# Altium project Main.PrjPcb
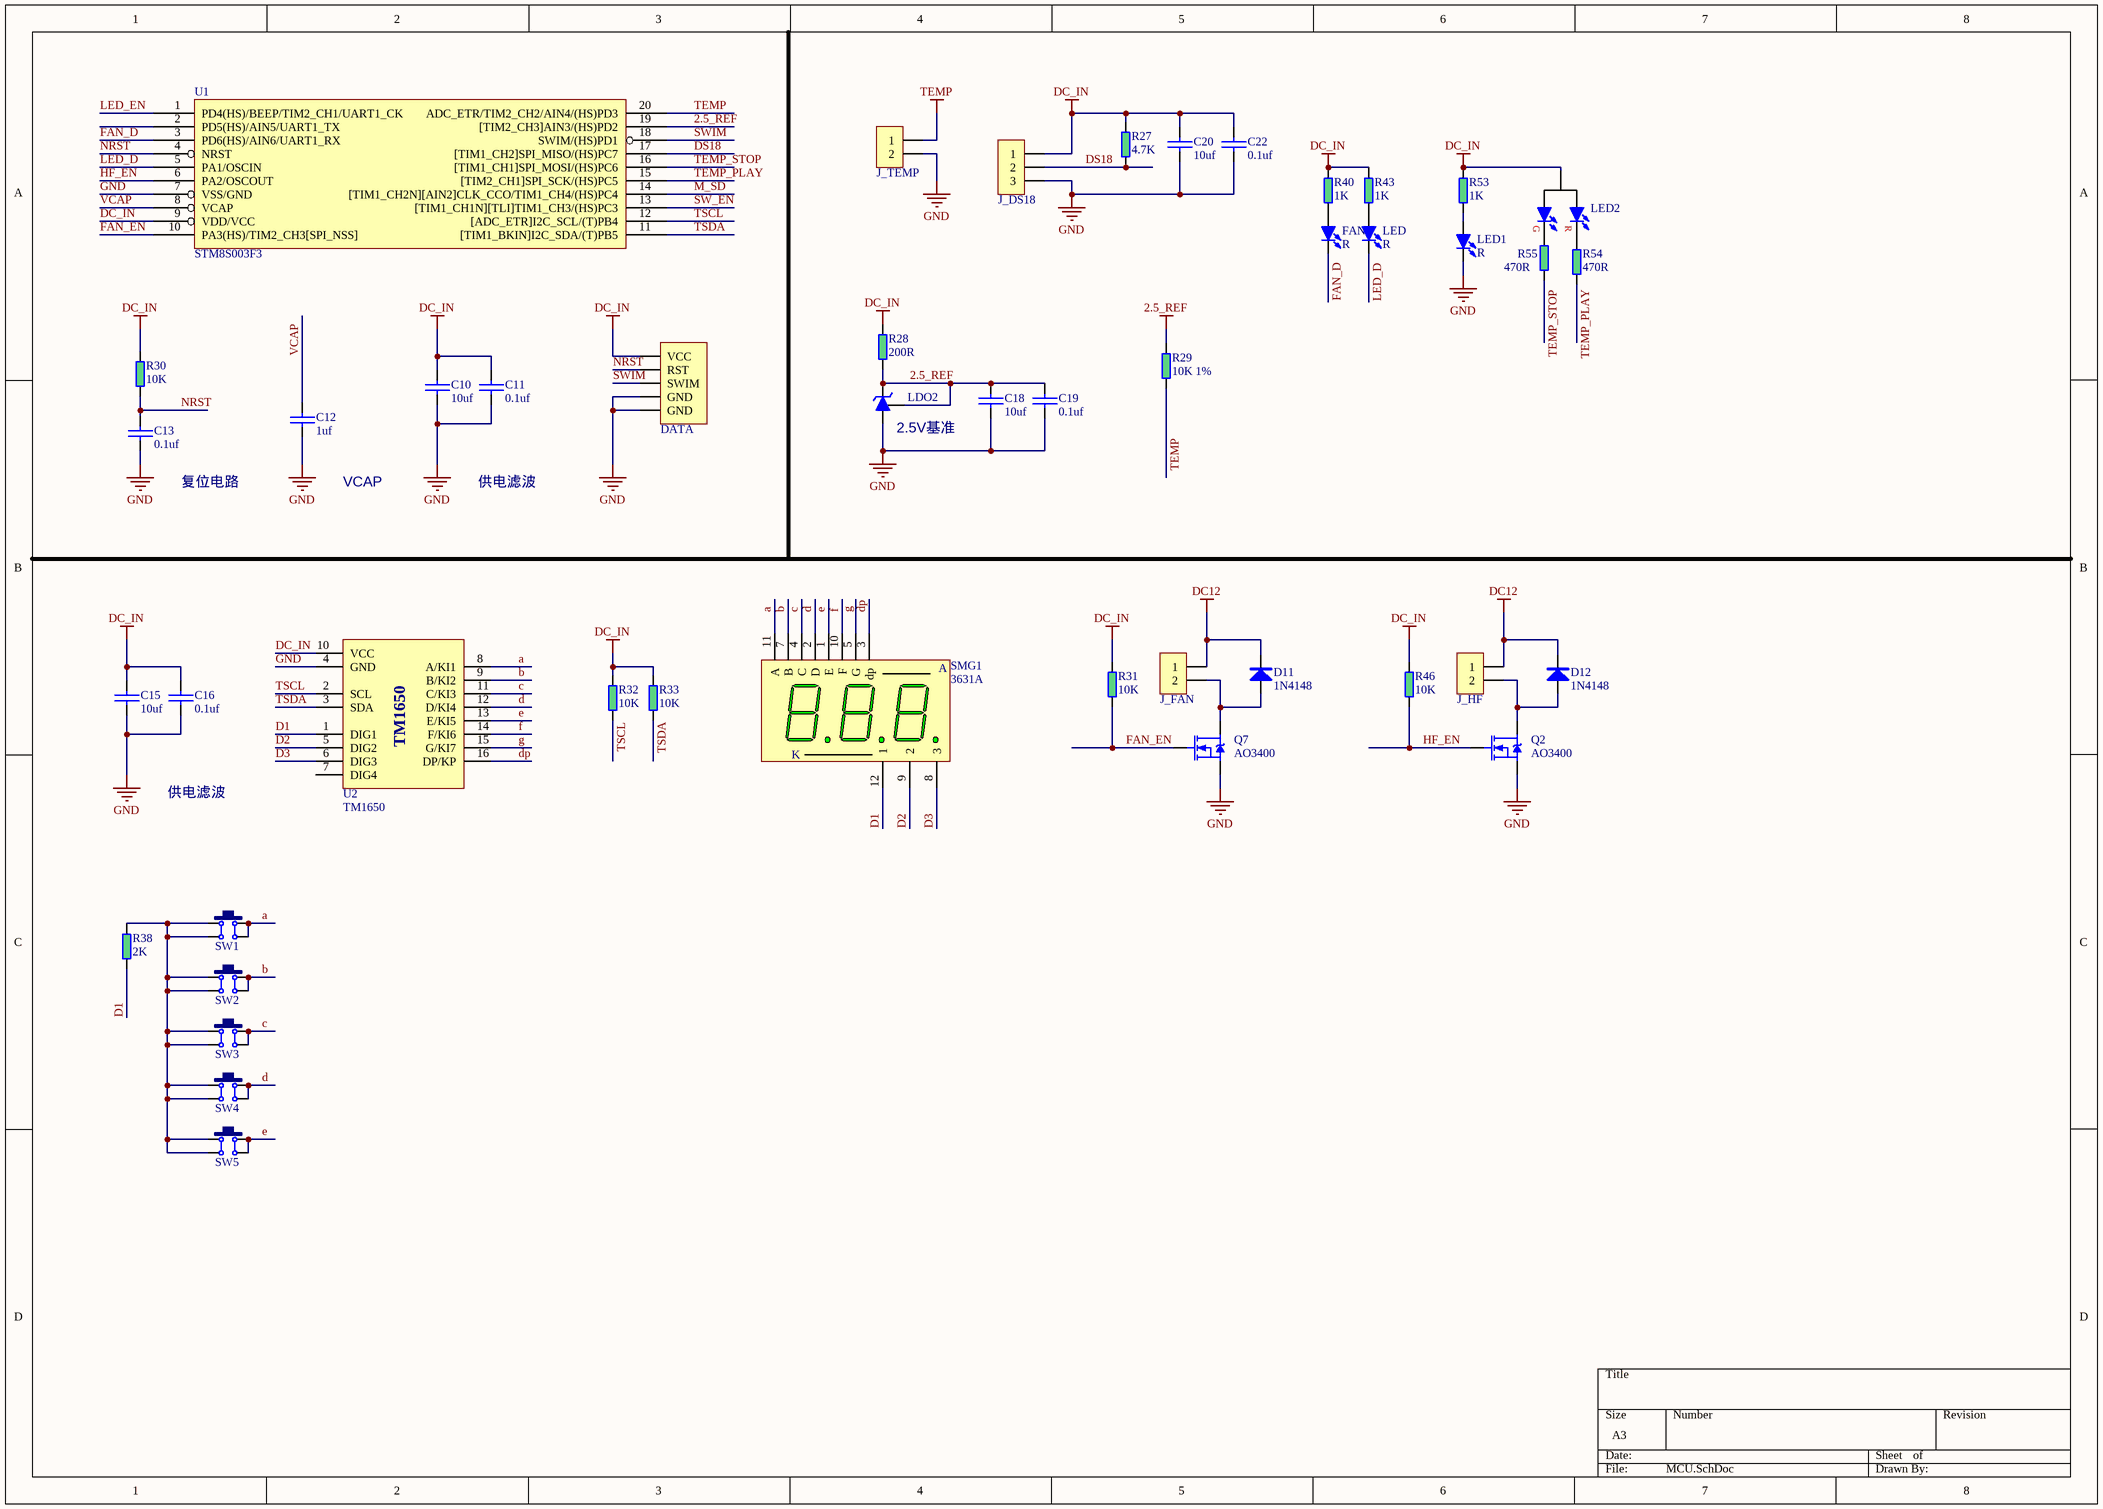
[diagram p0: MCU.SchDoc]
5 sheets, 143 parts. Net scope: global (net labels, ports and power ports of the same name join across sheets).
Board file: PCB1.PcbDoc
Sheets:
  MCU.SchDoc
  LM358.SchDoc
  AC.SchDoc
  5V.SchDoc
  LED.SchDoc

## Sheet MCU.SchDoc
size A3

### Parts
C10  value 10uf  [C 0603]  (hidden comment: 04.Cap)
C11  value 0.1uf  [C 0603]  (hidden comment: 04.Cap)
C12  value 1uf  [C 0603]  (hidden comment: 04.Cap)
C13  value 0.1uf  [C 0603]  (hidden comment: 04.Cap)
C15  value 10uf  [C 0603]  (hidden comment: 04.Cap)
C16  value 0.1uf  [C 0603]  (hidden comment: 04.Cap)
C18  value 10uf  [C 0603]  (hidden comment: 04.Cap)
C19  value 0.1uf  [C 0603]  (hidden comment: 04.Cap)
C20  value 10uf  [C 0603]  (hidden comment: 04.Cap)
C22  value 0.1uf  [C 0603]  (hidden comment: 04.Cap)
D11  1N4148  [D 1N4148-LL34]
D12  1N4148  [D 1N4148-LL34]
DATA  WR_STM-SWIM  [MCU_WRITE]  (value not drawn)
FAN  R  [LED 0603B]
J_DS18  Pin03  [XH2.54 3P]  (value not drawn)
J_FAN  Pin02  [XH2.54 2P]  (value not drawn)
J_HF  Pin02  [XH2.54 2P]  (value not drawn)
J_TEMP  Pin02  [XH2.54 2P]  (value not drawn)
LDO2  TL431  [P TL431-SOT23]  (value not drawn)
LED  R  [LED 0603B]
LED1  R  [LED 3mm R]
LED2  15.Diode - PLED - double  [LED 3mm R/G]  (value not drawn)
Q2  AO3400  [FET-AO3400-SOT23]
Q7  AO3400  [FET-AO3400-SOT23]
R27  4.7K  [R 0603]
R28  200R  [R 0603]
R29  10K 1%  [R 0805]
R30  10K  [R 0603]
R31  10K  [R 0603]
R32  10K  [R 0603]
R33  10K  [R 0603]
R38  2K  [R 0603]
R40  1K  [R 0603]
R43  1K  [R 0603]
R46  10K  [R 0603]
R53  1K  [R 0603]
R54  470R  [R 0603]
R55  470R  [R 0603]
SMG1  3631A  [SMG 0.36-3P]
SW1  TSW DIP-6x6  [TSW DIP-6*6]  (value not drawn)
SW2  TSW DIP-6x6  [TSW DIP-6*6]  (value not drawn)
SW3  TSW DIP-6x6  [TSW DIP-6*6]  (value not drawn)
SW4  TSW DIP-6x6  [TSW DIP-6*6]  (value not drawn)
SW5  TSW DIP-6x6  [TSW DIP-6*6]  (value not drawn)
U1  STM8S003F3  [TSSOP20]
U2  TM1650  [SOP16]

### Nets
2.5_REF: C18.1 C19.1 LDO2.K LDO2.R R28.1 R29.2 U1.19([TIM2_CH3]AIN3/(HS)PD2)
DC12: D11.K D12.K J_FAN.1 J_HF.1
DC_IN: C10.1 C11.1 C15.1 C16.1 C20.1 C22.1 DATA.1(VCC) J_DS18.1 LED2.A R27.2 R28.2 R30.2 R31.2 R32.2 R33.2 R40.2 R43.2 R46.2 R53.2 U1.9(VDD/VCC) U2.10(VCC)
GND: C10.2 C11.2 C12.2 C13.2 C15.2 C16.2 C18.2 C19.2 C20.2 C22.2 DATA.4(GND) DATA.5(GND) J_DS18.3 J_TEMP.2 LDO2.A LED1.K Q2.S Q7.S U1.7(VSS/GND) U2.4(GND)
TEMP: J_TEMP.1 R29.1 U1.20(ADC_ETR/TIM2_CH2/AIN4/(HS)PD3)
a: SMG1.11(A) SW1.C SW1.D U2.8(A/KI1)
b: SMG1.7(B) SW2.C SW2.D U2.9(B/KI2)
c: SMG1.4(C) SW3.C SW3.D U2.11(C/KI3)
d: SMG1.2(D) SW4.C SW4.D U2.12(D/KI4)
D1: R38.1 SMG1.12(1) U2.1(DIG1)
D2: SMG1.9(2) U2.5(DIG2)
D3: SMG1.8(3) U2.6(DIG3)
dp: SMG1.3(dp) U2.16(DP/KP)
DS18: J_DS18.2 R27.1 U1.17([TIM1_CH2]SPI_MISO/(HS)PC7)
e: SMG1.1(E) SW5.C SW5.D U2.13(E/KI5)
f: SMG1.10(F) U2.14(F/KI6)
FAN_D: FAN.K U1.3(PD6(HS)/AIN6/UART1_RX)
FAN_EN: Q7.G R31.1 U1.10(PA3(HS)/TIM2_CH3[SPI_NSS])
g: SMG1.5(G) U2.15(G/KI7)
HF_EN: Q2.G R46.1 U1.6(PA2/OSCOUT)
LED_D: LED.K U1.5(PA1/OSCIN)
LED_EN: U1.1(PD4(HS)/BEEP/TIM2_CH1/UART1_CK)
M_SD: U1.14([TIM1_CH2N][AIN2]CLK_CCO/TIM1_CH4/(HS)PC4)
NRST: C13.1 DATA.2(RST) R30.1 U1.4(NRST)
SW_EN: U1.13([TIM1_CH1N][TLI]TIM1_CH3/(HS)PC3)
SWIM: DATA.3(SWIM) U1.18(SWIM/(HS)PD1)
TEMP_PLAY: R54.1 U1.15([TIM2_CH1]SPI_SCK/(HS)PC5)
TEMP_STOP: R55.1 U1.16([TIM1_CH1]SPI_MOSI/(HS)PC6)
TSCL: R32.1 U1.12([ADC_ETR]I2C_SCL/(T)PB4) U2.2(SCL)
TSDA: R33.1 U1.11([TIM1_BKIN]I2C_SDA/(T)PB5) U2.3(SDA)
VCAP: C12.1 U1.8(VCAP)
NetD11_A: D11.A J_FAN.2 Q7.D
NetD12_A: D12.A J_HF.2 Q2.D
NetFAN_A: FAN.A R40.1
NetLED1_A: LED1.A R53.1
NetLED2_G: LED2.G R55.2
NetLED2_R: LED2.R R54.2
NetLED_A: LED.A R43.1
NetR38_2: R38.2 SW1.A SW1.B SW2.A SW2.B SW3.A SW3.B SW4.A SW4.B SW5.A SW5.B

Not connected (* = marked no-connect by the designer): U1 2(PD5(HS)/AIN5/UART1_TX); U2 7(DIG4)

### Notes on the sheet
- (near LDO2) 2.5V基准
- (near C13) 复位电路
- VCAP
- 供电滤波
- (in symbol 3631A) K

### Library data of the parts
C10-C13 C15 C16 C18-C20 C22 = 04.Cap: 电容
D11 D12 = 12.Diode: 二极管
FAN LED LED1 = 15.Diode - LED: LED
LDO2 = TL431: 电压基准（out=Ref*(1+R1/R2)）
Q2 Q7 = 09.FET(N): MOS管 NPN
R27-R33 R38 R40 R43 R46 R53-R55 = 01.Res: 电阻
SMG1 = 3631A: 0.36寸3位共阴数码管; 版权归属: 源创客; BOM名称: 0.36寸3位共阴; 学习资源: www.ooocke.com
SW1-SW5 = TSW DIP-6x6: 6x6轻触开关; BOM名称: 6x6轻触开关
U1 = STM8S003F3P6 - TSSOP20
U2 = TM1650: 数码管驱动芯片

## Sheet LM358.SchDoc
size A4
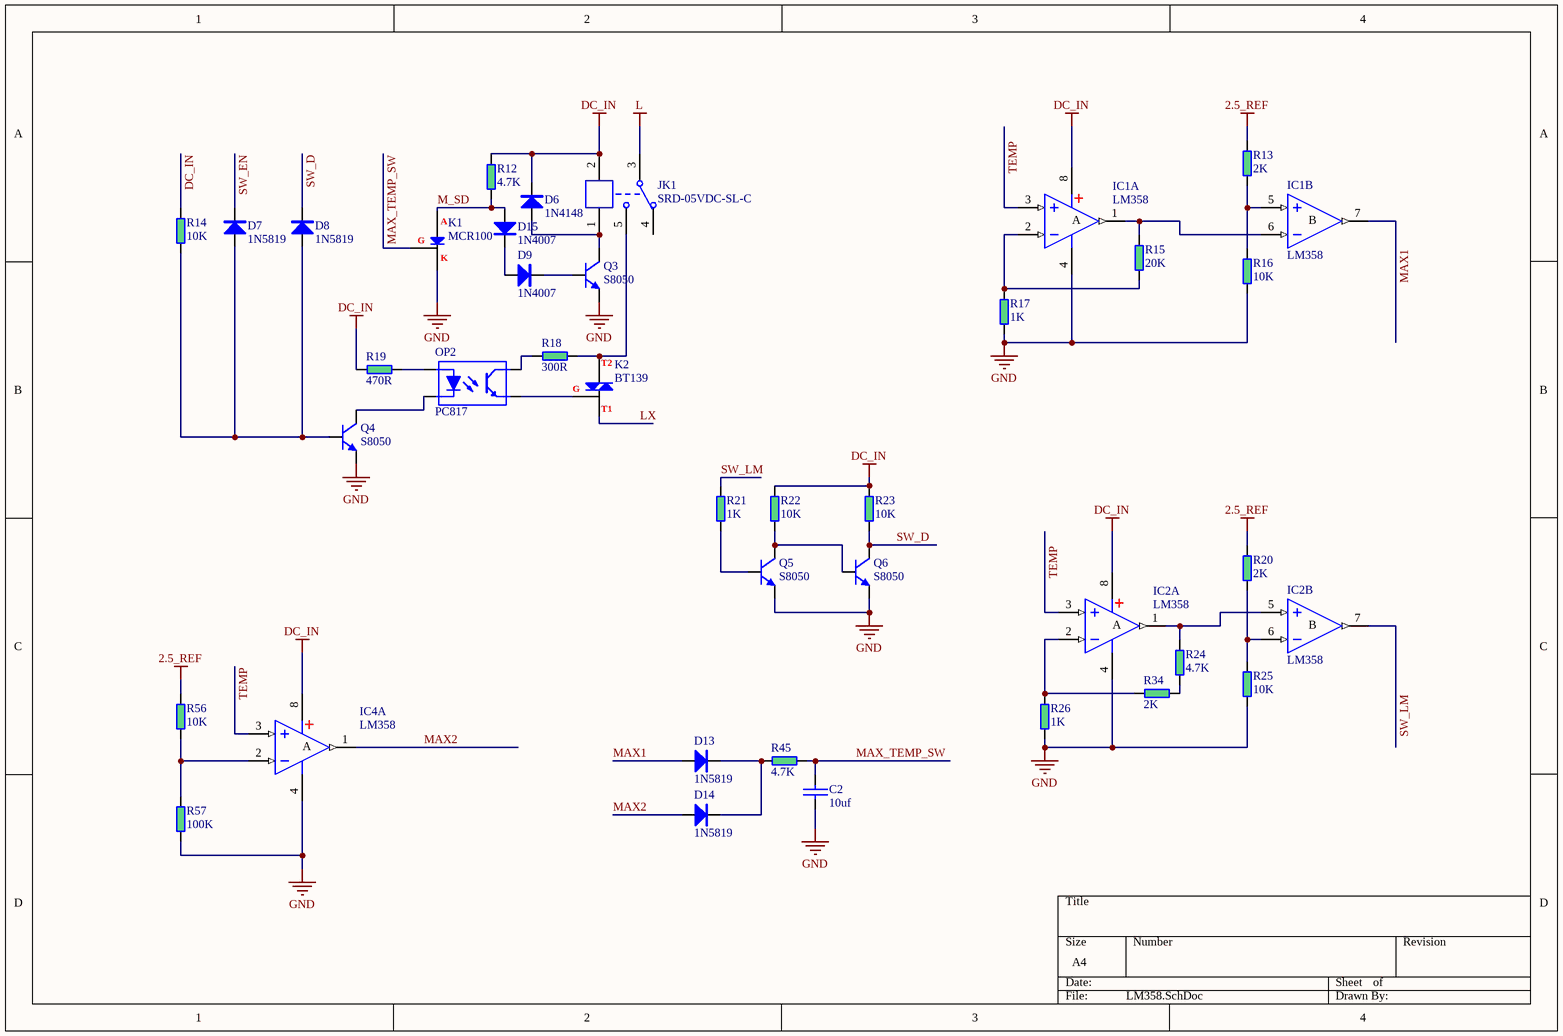
[diagram p1: LM358.SchDoc]

### Parts
C2  value 10uf  [C 0603]  (hidden comment: 04.Cap)
D6  1N4148  [D 1N4148-LL34]
D7  1N5819  [D 1N5819W-SOD123]
D8  1N5819  [D 1N5819W-SOD123]
D9  1N4007  [D 1N4007-SOD123]
D13  1N5819  [D 1N5819W-SOD123]
D14  1N5819  [D 1N5819W-SOD123]
D15  1N4007  [D 1N4007-SOD123]
IC1  LM358  [SOP8]  (parts A,B of 2)
IC2  LM358  [SOP8]  (parts A,B of 2)
IC4  LM358  [SOP8]  (part A of 2)
JK1  SRD-05VDC-SL-C  [SRD-C_B]
K1  MCR100  [IGBT MCR100-SOT23]
K2  BT139  [IGBT BT139]
OP2  PC817  [OP MOC3041]
Q3  S8050  [BJT-S8050-SOT23]
Q4  S8050  [BJT-S8050-SOT23]
Q5  S8050  [BJT-S8050-SOT23]
Q6  S8050  [BJT-S8050-SOT23]
R12  4.7K  [R 0603]
R13  2K  [R 0603]
R14  10K  [R 0603]
R15  20K  [R 0603]
R16  10K  [R 0603]
R17  1K  [R 0603]
R18  300R  [RS 1/4W-V3]
R19  470R  [R 0603]
R20  2K  [R 0603]
R21  1K  [R 0603]
R22  10K  [R 0603]
R23  10K  [R 0603]
R24  4.7K  [R 0603]
R25  10K  [R 0603]
R26  1K  [R 0603]
R34  2K  [R 0603]
R45  4.7K  [R 0603]
R56  10K  [R 0603]
R57  100K  [R 0603]

### Nets
2.5_REF: R13.2 R20.2 R56.2
DC_IN: D6.K IC1.8(V+) IC2.8(V+) IC4.8(V+) JK1.2 R12.2 R14.2 R19.1 R22.2 R23.2
GND: C2.2 IC1.4(V-) IC2.4(V-) IC4.4(V-) K1.K Q3.E Q4.E Q5.E Q6.E R16.1 R17.1 R25.1 R26.1 R57.1
L: JK1.3
TEMP: IC1.3(IN+) IC2.3(IN+) IC4.3(IN+)
LX: K2.T1
M_SD: D15.A K1.A R12.1
MAX1: D13.A IC1.7(OUT)
MAX2: D14.A IC4.1(OUT)
MAX_TEMP_SW: C2.1 K1.G R45.2
SW_D: D8.K Q6.C R23.1
SW_EN: D7.K
SW_LM: IC2.7(OUT) R21.2
NetD6_A: D6.A JK1.1 Q3.C
NetD7_A: D7.A D8.A Q4.B R14.1
NetD9_A: D9.A D15.K
NetD9_K: D9.K Q3.B
NetD13_K: D13.K D14.K R45.1
NetIC1_1: IC1.1(OUT) IC1.6(IN-) R15.2
NetIC1_2: IC1.2(IN-) R15.1 R17.2
NetIC1_5: IC1.5(IN+) R13.1 R16.2
NetIC2_1: IC2.1(OUT) IC2.5(IN+) R24.2
NetIC2_2: IC2.2(IN-) R26.2 R34.1
NetIC2_6: IC2.6(IN-) R20.1 R25.2
NetIC4_2: IC4.2(IN-) R56.1 R57.2
NetJK1_5: JK1.5 K2.T2 R18.2
NetK2_G: K2.G OP2.E
NetOP2_A: OP2.A R19.2
NetOP2_C: OP2.C R18.1
NetOP2_K: OP2.K Q4.C
NetQ5_B: Q5.B R21.1
NetQ5_C: Q5.C Q6.B R22.1
NetR24_1: R24.1 R34.2

Not connected (* = marked no-connect by the designer): JK1 4

### Notes on the sheet
- (in symbol LM358, part A) A
- (in symbol LM358, part B) B

### Library data of the parts
C2 = 04.Cap: 电容
D6-D9 D13-D15 = 12.Diode: 二极管
IC1 IC2 IC4 = LM358: 双路运放; 版权归属: 源创客; BOM名称: 双路运放; 学习资源: www.ooocke.com
JK1 = SRD-05VDC-SL-C: 5V一组转换; BOM名称: 5V继电器; 版权归属: 源创客; 学习资源: www.ooocke.com
K1 = 20.IGBT: 单向可控硅-晶闸管
K2 = 19.IGBT-Bi: 双向可控硅-晶闸管
OP2 = 17.Optocoupler: 光耦
Q3-Q6 = 07.BJT(N): 三极管 NPN
R12-R26 R34 R45 R56 R57 = 01.Res: 电阻

## Sheet AC.SchDoc
size A4
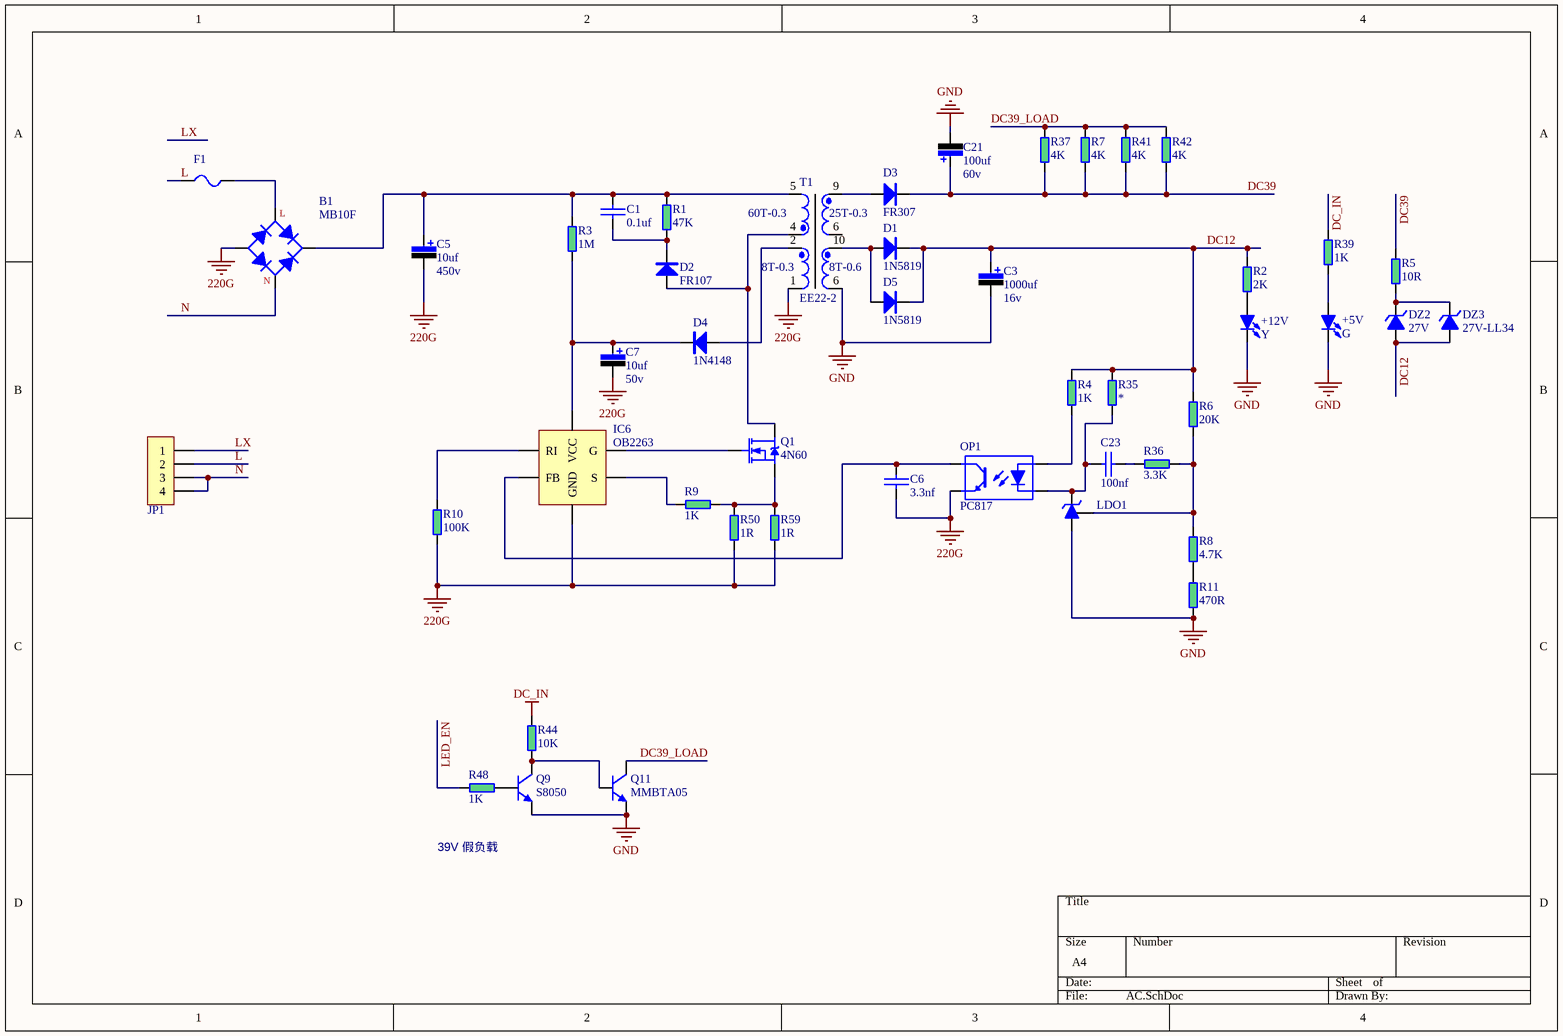
[diagram p2: AC.SchDoc]

### Parts
+5V  G  [LED 0603B]
+12V  Y  [LED 0603B]
B1  MB10F  [D MBF]
C1  value 0.1uf  [CY 5*7]  (hidden comment: 04.Cap)
C3  value 1000uf  value 16v  [CAP 16v1000uf（8*11）]  (hidden comment: 05.Cap-EC)
C5  value 10uf  value 450v  [CAP 450v10uf（10*16）]  (hidden comment: 05.Cap-EC)
C6  value 3.3nf  [C 0603]  (hidden comment: 04.Cap)
C7  value 10uf  value 50v  [CAP 50v10uf（5*8）]  (hidden comment: 05.Cap-EC)
C21  value 100uf  value 60v  [CAP 63V100uf（8*11）]  (hidden comment: 05.Cap-EC)
C23  value 100nf  [C 0603]  (hidden comment: 04.Cap)
D1  1N5819  [DO-41V]
D2  FR107  [DO-41]
D3  FR307  [DO-201ADV]
D4  1N4148  [D 1N4148-LL34]
D5  1N5819  [DO-41V]
DZ2  27V  [D 1N4750/1W/27V/LL41]
DZ3  27V-LL34  [D ZMM4V7-LL34]
F1  11.Fuse  [FU 3x10]  (value not drawn)
IC6  OB2263  [SOT23-6L]
JP1  Pin04  [KF7620-4P]  (value not drawn)
LDO1  TL431  [P TL431-SOT23]  (value not drawn)
OP1  PC817  [OP PC817-SMD]
Q1  4N60  [FET-AOD4N60/600V/4A-TO252]
Q9  S8050  [BJT-S8050/40V/1.5A-SOT23]
Q11  MMBTA05  [BJT-MMBTA05/60V/0.5A-SOT23]
R1  47K  [RS 1/2W-V4]
R2  2K  [R 0603]
R3  1M  [RS 1/4W-V3]
R4  1K  [R 0603]
R5  10R  [R 1206]
R6  20K  [R 0603]
R7  4K  [RS 1W-V5]
R8  4.7K  [R 0603]
R9  1K  [R 0603]
R10  100K  [R 0603]
R11  470R  [R 0603]
R35  *  [R 0603]
R36  3.3K  [R 0603]
R37  4K  [RS 1W-V5]
R39  1K  [R 0603]
R41  4K  [RS 1W-V5]
R42  4K  [RS 1W-V5]
R44  10K  [R 0603]
R48  1K  [R 0603]
R50  1R  [R 1206]
R59  1R  [R 1206]
T1  EE22-2  [EE22]

### Nets
220G: B1.DC- C5.2 C6.2 C7.2 IC6.1(GND) OP1.E R10.1 R50.1 R59.1 T1.1(Sec2-)
DC12: C3.1 D1.K D5.K DZ2.A DZ3.A R2.2 R4.2 R6.2 R35.2
DC_IN: R39.2 R44.2
GND: +5V.K +12V.K C3.2 C21.2 LDO1.A Q9.E Q11.E R11.1 T1.6(Pri-)
L: F1.1 JP1.2
DC39: C21.1 D3.K R5.1 R7.2 R37.2 R41.2 R42.2
DC39_LOAD: Q11.C R7.1 R37.1 R41.1 R42.1
LED_EN: R48.1
LX: JP1.1
N: B1.AC2 JP1.3 JP1.4
Net+5V_A: +5V.A R39.1
Net+12V_A: +12V.A R2.1
NetB1_AC1: B1.AC1 F1.2
NetB1_DC+: B1.DC+ C1.1 C5.1 R1.1 R3.1 T1.5(Sec1+)
NetC1_2: C1.2 D2.K R1.2
NetC6_1: C6.1 IC6.2(FB) OP1.C
NetC7_1: C7.1 D4.K IC6.5(VCC) R3.2
NetC23_1: C23.1 LDO1.K OP1.K R35.1
NetC23_2: C23.2 R36.1
NetD1_A: D1.A D5.A T1.10(Pri+)
NetD2_A: D2.A Q1.D T1.4(Sec1-)
NetD3_A: D3.A T1.9(Pri+)
NetD4_A: D4.A T1.2(Sec2+)
NetDZ2_K: DZ2.K DZ3.K R5.2
NetIC6_3: IC6.3(RI) R10.2
NetIC6_4: IC6.4(S) R9.1
NetIC6_6: IC6.6(G) Q1.G
NetLDO1_R: LDO1.R R6.1 R8.2 R36.2
NetOP1_A: OP1.A R4.1
NetQ1_S: Q1.S R9.2 R50.2 R59.2
NetQ9_B: Q9.B R48.2
NetQ9_C: Q9.C Q11.B R44.1
NetR8_1: R8.1 R11.2

### Notes on the sheet
- (near T1) 60T-0.3
- (near T1) 25T-0.3
- (near T1) 8T-0.3
- (near T1) 8T-0.6
- 39V 假负载
- (in symbol 14.Diode - Rectifier) L; N

### Library data of the parts
+5V +12V = 15.Diode - LED: LED
B1 = 14.Diode - Rectifier: 整流桥
C1 C6 C23 = 04.Cap: 电容
C3 C5 C7 C21 = 05.Cap-EC: 电解电容
D1-D5 = 12.Diode: 二极管
DZ2 DZ3 = 13.Diode - Zen: 稳压管
F1 = 11.Fuse: 保险丝
LDO1 = TL431: 电压基准（out=Ref*(1+R1/R2)）
OP1 = 17.Optocoupler: 光耦
Q1 = 09.FET(N): MOS管 NPN
Q9 Q11 = 07.BJT(N): 三极管 NPN
R1-R11 R35-R37 R39 R41 R42 R44 R48 R50 R59 = 01.Res: 电阻

## Sheet 5V.SchDoc
size A4
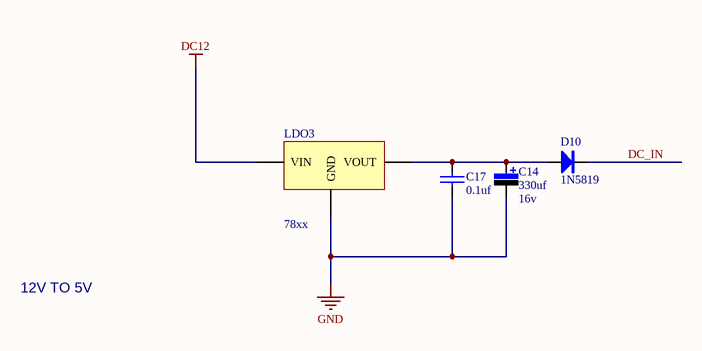
[diagram p3: 5V.SchDoc]

### Parts
C14  value 330uf  value 16v  [CAP 16v330uf（6*8）]  (hidden comment: 05.Cap-EC)
C17  value 0.1uf  [C 0603]  (hidden comment: 04.Cap)
D10  1N5819  [D 1N5819W-SOD123]
LDO3  78xx  [78M05]

### Nets
DC12: LDO3.VIN
DC_IN: D10.K
GND: C14.2 C17.2 LDO3.GND
NetC14_1: C14.1 C17.1 D10.A LDO3.VOUT

### Notes on the sheet
- 12V TO 5V

### Library data of the parts
C14 = 05.Cap-EC: 电解电容
C17 = 04.Cap: 电容
D10 = 12.Diode: 二极管
LDO3 = 78xx: 线性稳压芯片; 版权归属: 源创客; BOM名称: 线性稳压芯片; 学习资源: www.ooocke.com

## Sheet LED.SchDoc
size A4
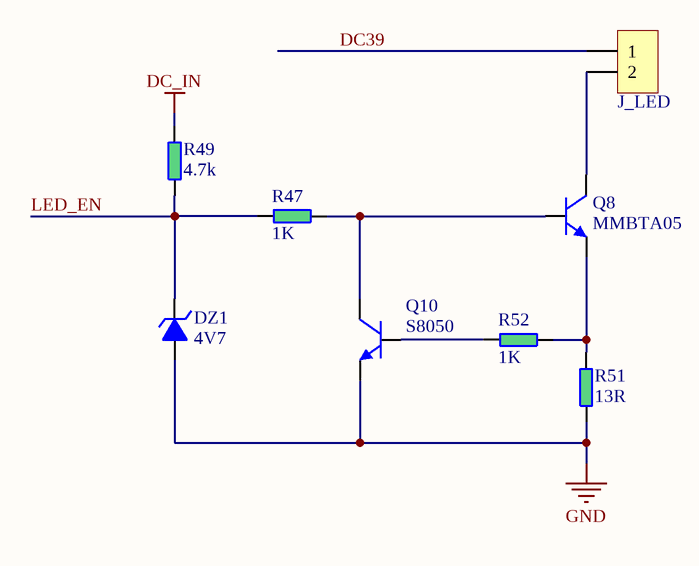
[diagram p4: LED.SchDoc]

### Parts
DZ1  4V7  [D ZMM4V7-LL34]
J_LED  Pin02  [XH2.54 2P]  (value not drawn)
Q8  MMBTA05  [BJT-MMBTA05/60V/0.5A-SOT23]
Q10  S8050  [BJT-S8050-SOT23]
R47  1K  [R 0805]
R49  4.7k  [R 0603]
R51  13R  [R 0805]
R52  1K  [R 0603]

### Nets
DC_IN: R49.2
GND: DZ1.A Q10.E R51.1
DC39: J_LED.1
LED_EN: DZ1.K R47.1 R49.1
NetJ_LED_2: J_LED.2 Q8.C
NetQ8_B: Q8.B Q10.C R47.2
NetQ8_E: Q8.E R51.2 R52.2
NetQ10_B: Q10.B R52.1

### Library data of the parts
DZ1 = 13.Diode - Zen: 稳压管
Q8 Q10 = 07.BJT(N): 三极管 NPN
R47 R49 R51 R52 = 01.Res: 电阻

## Nets that join several sheets
2.5_REF: MCU (7 pins), LM358 (R13.2 R20.2 R56.2)
DC12: MCU (D11.K D12.K J_FAN.1 J_HF.1), AC (9 pins), 5V (LDO3.VIN)
DC_IN: MCU (21 pins), LM358 (10 pins), AC (R39.2 R44.2), 5V (D10.K), LED (R49.2)
GND: MCU (20 pins), LM358 (14 pins), AC (9 pins), 5V (C14.2 C17.2 LDO3.GND), LED (DZ1.A Q10.E R51.1)
L: LM358 (JK1.3), AC (F1.1 JP1.2)
TEMP: MCU (J_TEMP.1 R29.1 U1.20), LM358 (IC1.3 IC2.3 IC4.3)
DC39: AC (7 pins), LED (J_LED.1)
LED_EN: MCU (U1.1), AC (R48.1), LED (DZ1.K R47.1 R49.1)
LX: LM358 (K2.T1), AC (JP1.1)
M_SD: MCU (U1.14), LM358 (D15.A K1.A R12.1)
SW_EN: MCU (U1.13), LM358 (D7.K)